# EAGLE design 2021-03-01_HALO_RGB_Board (EAGLE 9.6.2)
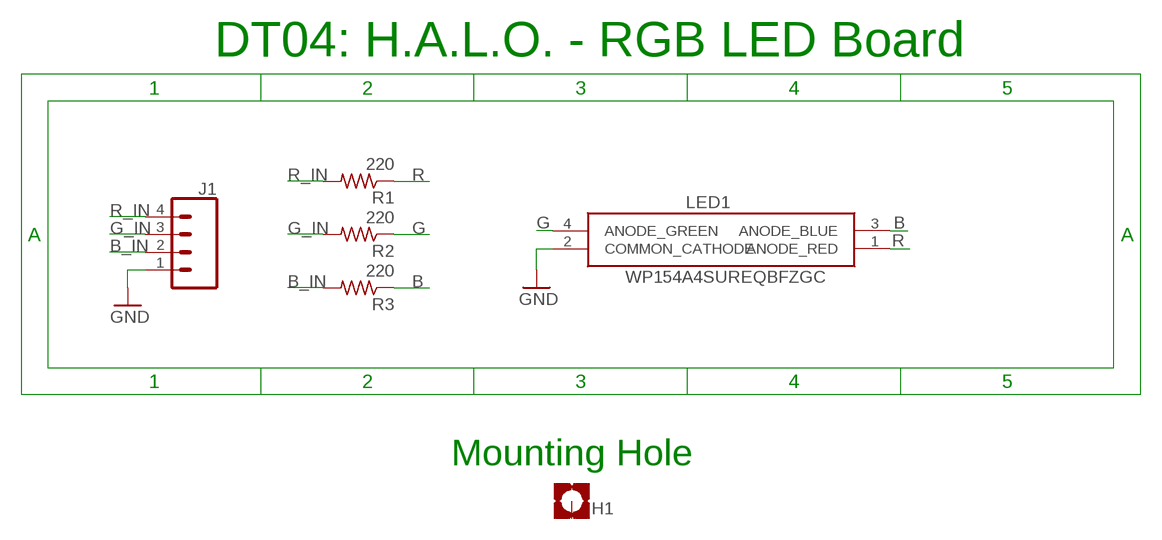
[diagram p0: schematic, sheet 1]

## Parts
H1  MOUNT-PAD-SQUARE3.0  [3,0-PAD-SQUARE]
J1  CONN_04  [1X04]
LED1  WP154A4SUREQBFZGC  [L-154A4SUREQBFZGEC]
R1  220  R-US_R0805  [R0805]
R2  220  R-US_R0805  [R0805]
R3  220  R-US_R0805  [R0805]

## Nets
B: LED1.3(ANODE_BLUE) R3.1
B_IN: J1.2 R3.2
G: LED1.4(ANODE_GREEN) R2.1
G_IN: J1.3 R2.2
GND: J1.1 LED1.2(COMMON_CATHODE)
R: LED1.1(ANODE_RED) R1.1
R_IN: J1.4 R1.2
Unconnected: H1.B3,0(MOUNT)

## Notes on the sheet
- DT04: H.A.L.O. - RGB LED Board
- Mounting Hole

## Library data of the parts
H1 = holes:MOUNT-PAD-SQUARE: MOUNTING PAD, square
J1 = SparkFun-Connectors:CONN_04: Multi connection point. Often used as Generic Header-pin footprint for 0.1 inch spaced/style header connections On any of the 0.1 inch spaced packages, you can populate with these: Break Away Headers - Straight <https://www.sparkfun.com/products/116> (PRT-00116) Break Away Male Headers - Right Angle <https://www.sparkfun.com/products/553> (PRT-00553) Female Headers <https://www.sparkfun.com/products/115> (PRT-00115) Break Away Headers - Machine Pin <https://www.sparkfun.com/products/117> (PRT-00117) Break Away Female Headers - Swiss Machine Pin <https://www.sparkfun.com/products/743> (PRT-00743) For SCREWTERMINALS and SPRING TERMINALS visit here: Screw Terimnals on SparkFun.com <https://www.sparkfun.com/search/results?term=Screw+Terminals> (5mm/3.5mm/2.54mm spacing) This device is also useful as a general connection point to wire up your design to another part of your project. Our various solder wires solder well into these plated through hole pads. Hook-Up Wire - Assortment (Stranded, 22 AWG) <https://www.sparkfun.com/products/11375> (PRT-11375) Hook-Up Wire - Assortment (Solid Core, 22 AWG) <https://www.sparkfun.com/products/11367> (PRT-11367) View the entire wire category on our website here <https://www.sparkfun.com/categories/141> Special notes: Molex polarized connector foot print use with SKU : PRT-08231 with associated crimp pins and housings. 1MM SMD Version SKU: PRT-10208; PROD_ID: CONN-09696
LED1 = HALO_RGB_WP154A4SUREQBFZGC:WP154A4SUREQBFZGC: Standard LEDs - Through Hole RGB 630/525/465nm 750/420/750mcd 60Deg Source: Datasheet <http://www.kingbrightusa.com/images/catalog/SPEC/WP154A4SUREQBFZGC.pdf>; ARROW_PART_NUMBER: WP154A4SUREQBFZGC; ARROW_PRICE-STOCK: https://www.arrow.com/en/products/wp154a4sureqbfzgc/kingbright; DESCRIPTION: Standard LEDs - Through Hole RGB 630/525/465nm 750/420/750mcd 60Deg; HEIGHT: mm; MANUFACTURER_NAME: Kingbright; MANUFACTURER_PART_NUMBER: WP154A4SUREQBFZGC; MOUSER_PART_NUMBER: 604-WP154A4SUREQBFZG; MOUSER_PRICE-STOCK: https://www.mouser.co.uk/ProductDetail/Kingbright/WP154A4SUREQBFZGC?qs=vEWui5pQpauEeiZ%252Btq6oqQ%3D%3D
R1-R3 = rcl:R-US_: RESISTOR, American symbol

## Board
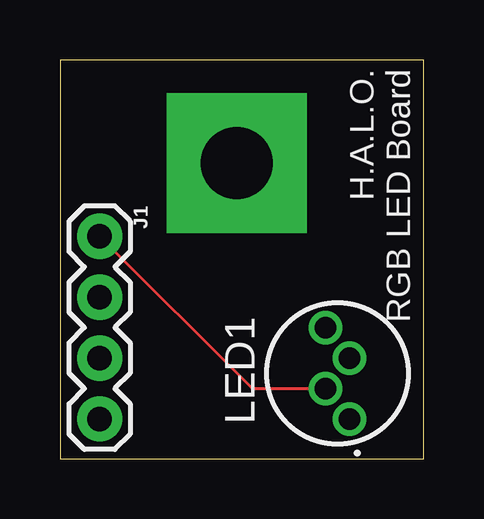
[diagram p1: board, top side]
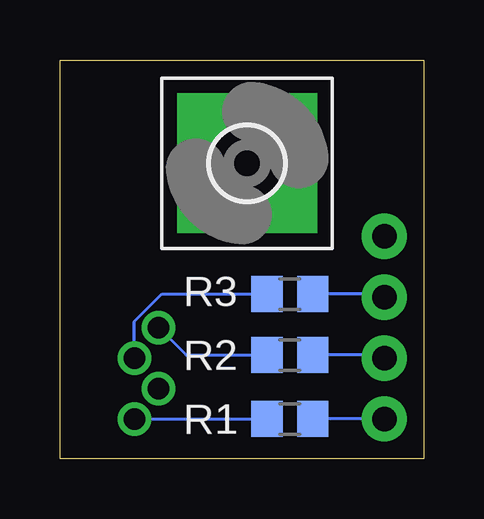
[diagram p2: board, bottom side, seen from below]

Size 15.16 x 16.63 mm. Coordinates in mm from the lower left corner, seen from the top.
Outline: 0,0 15.16,0 15.16,16.63 0,16.63 0,0
Copper layers (1*16): Top 0.035559375mm / dielectric 1.6mm / Bottom 0.035559375mm
Design rules "jlcpcb2layer": minimum track width 5mil, minimum drill 12mil, track to track 5mil, track to pad 5mil, pad to pad 5mil, via to via 5mil, smd to smd 5mil, copper to edge 8mil, drill to drill 6mil, minimum pad ring 5mil, minimum via ring 3mil, stop-mask expansion 2.5mil, vias tented up to drill 0mil, thermal gap 10mil

### Footprints (pad centres in the part's own frame; a part is rotated, then mirrored left to right if it is on the bottom)
3,0-PAD-SQUARE = drill 3 pad 5.842 square: B3,0 0,0
1X04 = drill 1.016 pad 1.88: 1 0,0; 2 2.54,0; 3 5.08,0; 4 7.62,0
L-154A4SUREQBFZGEC = drill 0.889 pad 1.4: 1 0.5,-1.905; 2 -0.5,-0.635; 3 0.5,0.635; 4 -0.5,1.905
R0805 = smd 1.3 x 1.5: 1 -0.95,0; 2 0.95,0

### Placement (x,y rotation side)
H1  7.37,12.32 0 bottom
J1  1.65,9.27 270 top
LED1  11.56,3.56 0 top
R1  5.59,1.65 0 bottom
R2  5.59,4.32 0 bottom
R3  5.59,6.86 0 bottom

### Tracks (layer width: path | path; a pad name or v marks a point on that pad's centre or on a via)
B
  Bottom 0.127: R3.1 10.92,6.86 12.06,5.71 LED1.3
B_IN
  Bottom 0.127: R3.2 1.78,6.86 J1.2
G
  Bottom 0.127: R2.1 9.91,4.32 11.05,5.46 LED1.4
G_IN
  Bottom 0.127: R2.2 1.78,4.32 J1.3
GND
  Top 0.127: LED1.2 8,2.92 J1.1
R
  Bottom 0.127: LED1.1 R1.1
R_IN
  Bottom 0.127: J1.4 R1.2

### Text on the board
tNames: H.A.L.O. / RGB LED Board